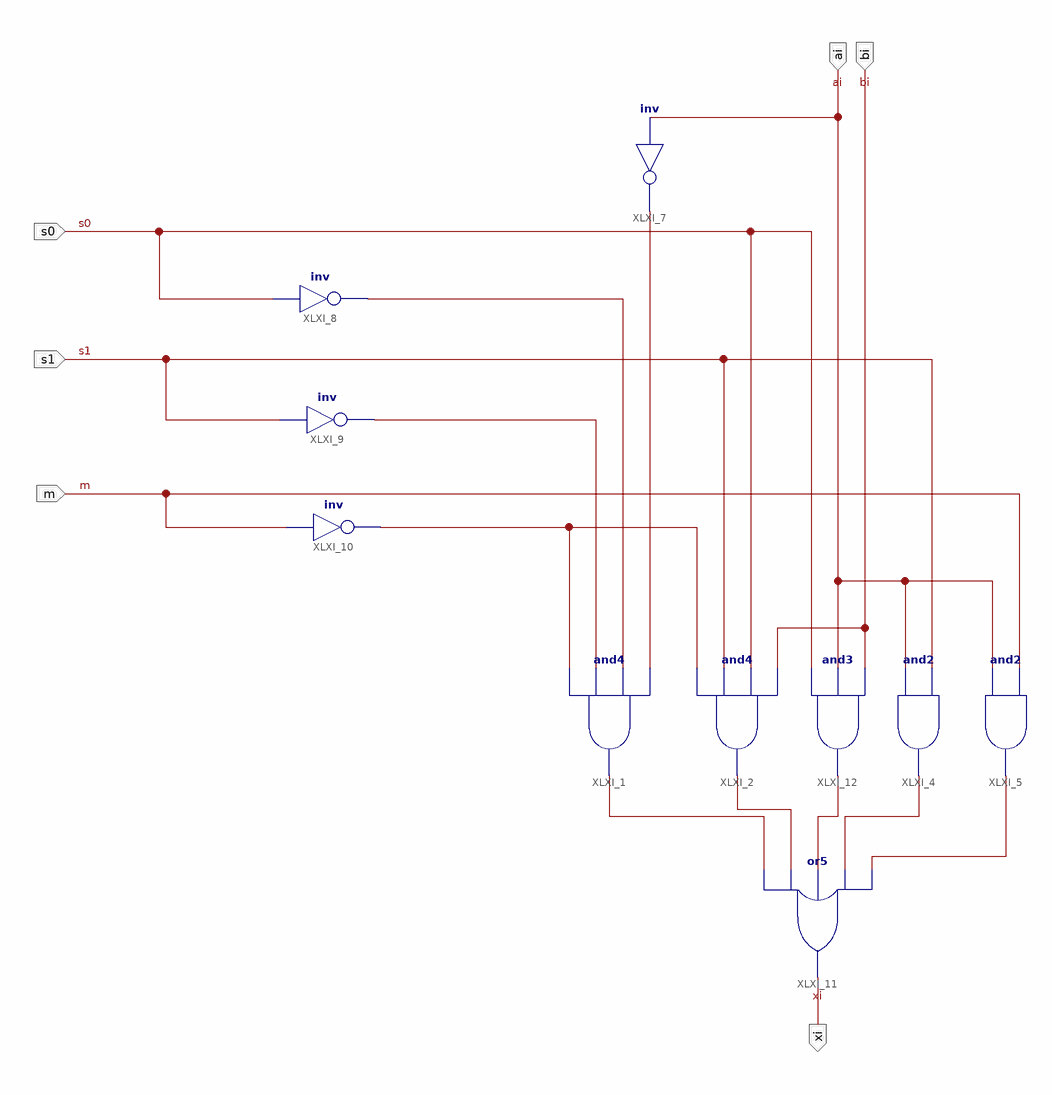
[diagram p0: schematic sheet 1]
// Xilinx ISE schematic logic_ext.sch (artix7) as structural Verilog: 10 symbols, 6 ports
module logic_ext (
  input  bi,
  input  s0,
  input  s1,
  input  m,
  input  ai,
  output xi
);

  wire XLXN_10, XLXN_11, XLXN_14, XLXN_15, XLXN_16, XLXN_17, XLXN_18, XLXN_19, XLXN_20;

  and XLXI_1 (XLXN_16, XLXN_14, XLXN_15, XLXN_10, XLXN_11);
  and XLXI_2 (XLXN_17, XLXN_14, s1, s0, bi);
  and XLXI_4 (XLXN_19, ai, s1);
  and XLXI_5 (XLXN_20, ai, m);
  not XLXI_7 (XLXN_11, ai);
  not XLXI_8 (XLXN_10, s0);
  not XLXI_9 (XLXN_15, s1);
  not XLXI_10 (XLXN_14, m);
  or XLXI_11 (xi, XLXN_16, XLXN_17, XLXN_18, XLXN_19, XLXN_20);
  and XLXI_12 (XLXN_18, s0, ai, bi);
endmodule
